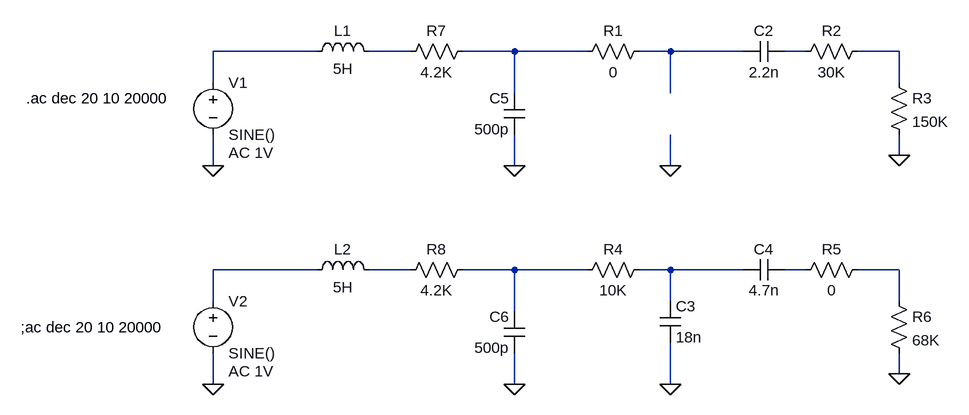
[diagram p0: schematic Filter_Loading_Simulations.asc]
Filter_Loading_Simulations.asc, the LTspice schematic file:
Version 4
SHEET 1 880 696
WIRE -416 160 -576 160
WIRE -272 160 -336 160
WIRE -112 160 -192 160
WIRE 0 160 -112 160
WIRE 128 160 80 160
WIRE 240 160 128 160
WIRE 336 160 304 160
WIRE 480 160 416 160
WIRE -576 208 -576 160
WIRE 480 208 480 160
WIRE -112 224 -112 160
WIRE 128 224 128 160
WIRE 480 320 480 288
WIRE -576 336 -576 288
WIRE -112 336 -112 288
WIRE 128 336 128 288
WIRE -416 496 -576 496
WIRE -272 496 -336 496
WIRE -112 496 -192 496
WIRE 0 496 -112 496
WIRE 128 496 80 496
WIRE 240 496 128 496
WIRE 336 496 304 496
WIRE 480 496 416 496
WIRE -576 544 -576 496
WIRE 128 544 128 496
WIRE 480 544 480 496
WIRE -112 560 -112 496
WIRE 480 656 480 624
WIRE -576 672 -576 624
WIRE -112 672 -112 624
WIRE 128 672 128 608
FLAG 480 320 0
FLAG -576 336 0
FLAG 480 656 0
FLAG -576 672 0
FLAG -112 336 0
FLAG -112 672 0
FLAG 128 336 0
FLAG 128 672 0
SYMBOL cap 304 144 R90
WINDOW 0 0 32 VBottom 2
WINDOW 3 32 32 VTop 2
SYMATTR InstName C2
SYMATTR Value 2.2n
SYMBOL res 464 192 R0
SYMATTR InstName R3
SYMATTR Value 150K
SYMBOL voltage -576 192 R0
WINDOW 123 24 124 Left 2
WINDOW 39 0 0 Left 0
SYMATTR Value2 AC 1V
SYMATTR InstName V1
SYMATTR Value SINE()
SYMBOL cap 304 480 R90
WINDOW 0 0 32 VBottom 2
WINDOW 3 32 32 VTop 2
SYMATTR InstName C4
SYMATTR Value 4.7n
SYMBOL res 464 528 R0
SYMATTR InstName R6
SYMATTR Value 68K
SYMBOL ind -432 176 R270
WINDOW 0 32 56 VTop 2
WINDOW 3 5 56 VBottom 2
SYMATTR InstName L1
SYMATTR Value 5H
SYMBOL res -176 144 R90
WINDOW 0 0 56 VBottom 2
WINDOW 3 32 56 VTop 2
SYMATTR InstName R7
SYMATTR Value 4.2K
SYMBOL cap -96 288 R180
WINDOW 0 24 56 Left 2
WINDOW 3 24 8 Left 2
SYMATTR InstName C5
SYMATTR Value 500p
SYMBOL voltage -576 528 R0
WINDOW 123 24 124 Left 2
WINDOW 39 0 0 Left 0
SYMATTR Value2 AC 1V
SYMATTR InstName V2
SYMATTR Value SINE()
SYMBOL ind -432 512 R270
WINDOW 0 32 56 VTop 2
WINDOW 3 5 56 VBottom 2
SYMATTR InstName L2
SYMATTR Value 5H
SYMBOL res -176 480 R90
WINDOW 0 0 56 VBottom 2
WINDOW 3 32 56 VTop 2
SYMATTR InstName R8
SYMATTR Value 4.2K
SYMBOL cap -96 624 R180
WINDOW 0 24 56 Left 2
WINDOW 3 24 8 Left 2
SYMATTR InstName C6
SYMATTR Value 500p
SYMBOL res 432 144 R90
WINDOW 0 0 56 VBottom 2
WINDOW 3 32 56 VTop 2
SYMATTR InstName R2
SYMATTR Value 30K
SYMBOL res 432 480 R90
WINDOW 0 0 56 VBottom 2
WINDOW 3 32 56 VTop 2
SYMATTR InstName R5
SYMATTR Value 0
SYMBOL res 96 144 R90
WINDOW 0 0 56 VBottom 2
WINDOW 3 32 56 VTop 2
SYMATTR InstName R1
SYMATTR Value 0
SYMBOL res 96 480 R90
WINDOW 0 0 56 VBottom 2
WINDOW 3 32 56 VTop 2
SYMATTR InstName R4
SYMATTR Value 10K
SYMBOL cap 112 544 R0
SYMATTR InstName C3
SYMATTR Value 18n
TEXT -864 232 Left 2 !.ac dec 20 10 20000
TEXT -872 584 Left 2 !;ac dec 20 10 20000

The netlist it stands for:
* Filter_Loading_Simulations.asc
C2 N005 N004 2.2n
R3 N006 0 150K
V1 N001 0 SINE() AC 1V
C4 N011 N010 4.7n
R6 N012 0 68K
L1 N001 N002 5H
R7 N003 N002 4.2K
C5 0 N003 500p
V2 N007 0 SINE() AC 1V
L2 N007 N008 5H
R8 N009 N008 4.2K
C6 0 N009 500p
R2 N006 N005 30K
R5 N012 N011 0
R1 N004 N003 0
R4 N010 N009 10K
C3 N010 0 18n
.ac dec 20 10 20000
;ac dec 20 10 20000
.backanno
.end